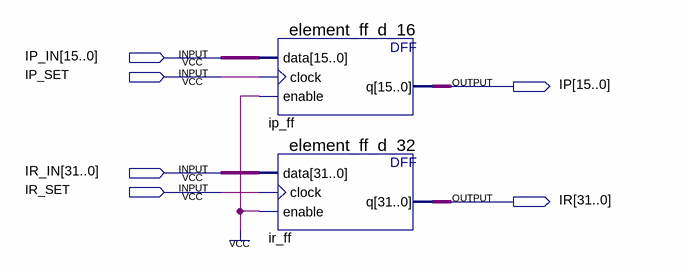
[diagram p0: schematic sheet]
// Quartus schematic block-instruction-registers.bdf as structural Verilog: 2 symbols, 6 pins
module \block-instruction-registers  (
  input  [15:0] IP_IN,
  input  IP_SET,
  input  [31:0] IR_IN,
  input  IR_SET,
  output [15:0] IP,
  output [31:0] IR
);

  element_ff_d_16 ip_ff (.data(IP_IN), .clock(IP_SET), .enable(1'b1), .q(IP));
  element_ff_d_32 ir_ff (.data(IR_IN), .clock(IR_SET), .enable(1'b1), .q(IR));
endmodule
